# EAGLE design ESP-WROOM-32-Breakout (EAGLE 6.6.0)
REV: 1
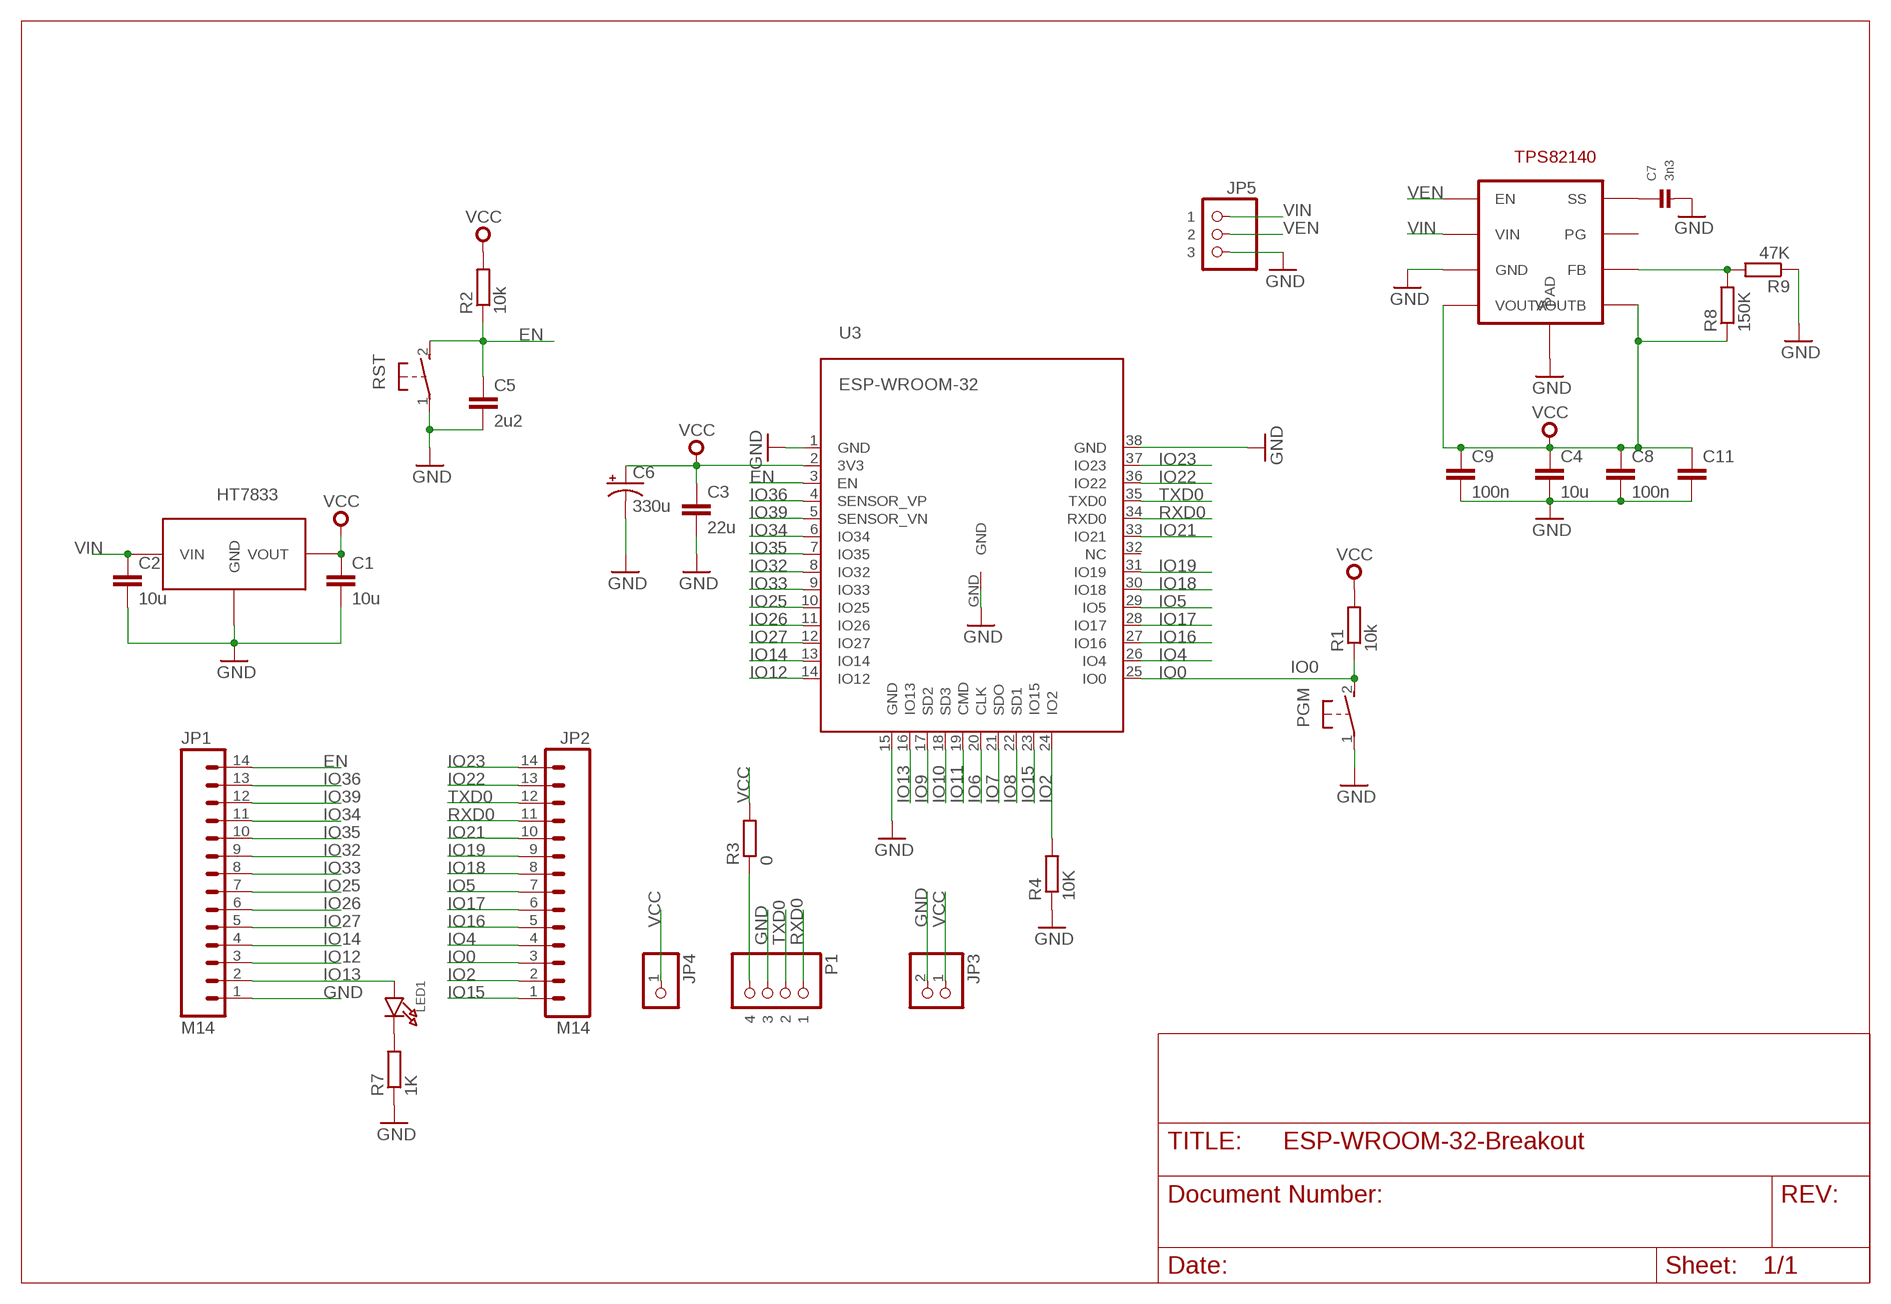
[diagram p0: schematic, sheet 1]

## Parts
C1  10u  C-EUC0603  [C0603]
C2  10u  C-EUC0603  [C0603]
C3  22u  CAP0805  [0805]
C4  10u  C-EUC0603  [C0603]
C5  2u2  C-EUC0603  [C0603]
C6  330u  CAP_POLSMD  [VISHAY_C]
C7  3n3  CAP_CERAMIC0603  [0603]
C8  100n  C-EUC0603  [C0603]
C9  100n  C-EUC0603  [C0603]
C11  CAPSMD  [GRM43D]
JP1  M14  [1X14]
JP2  M14  [1X14]
JP3  HEADER-1X2ROUND  [1X02_ROUND]
JP4  HEADER-1X1ROUND  [1X01_ROUND]
JP5  HEADER-1X3ROUND  [1X03_ROUND]
LED1  LED0603  [CHIPLED_0603]
P1  HEADER-1X4ROUND  [1X04_ROUND]
PGM  DTSM-3  [DTSM-3]
R1  10k  R-EU_R0603  [R0603]
R2  10k  R-EU_R0603  [R0603]
R3  0  R-EU_R0603  [R0603]
R4  10K  R-EU_R0603  [R0603]
R7  1K  R-EU_R0603  [R0603]
R8  150K  R-EU_R0603  [R0603]
R9  47K  R-EU_R0603  [R0603]
RST  DTSM-3  [DTSM-3]
U3  ESP-WROOM-32  [ESP-WROOM-32]
U$1  HT7833  HT7333  [SOT89]
U$2  TPS82140  [TPS82140]

## Nets
EN: C5.1 JP1.14 R2.1 RST.2 U3.3(EN)
GND [gnd]: C1.2 C2.2 C3.2 C4.2 C5.2 C6.- C7.2 C8.2 C9.2 C11.C JP1.1 JP3.2 JP5.3 P1.3 PGM.1 R4.1 R7.1 R9.1 RST.1 U3.1(GND) U3.15(GND) U3.38(GND) U3.GND U$1.GND U$2.P$3(GND) U$2.P$9(PAD)
IO0: JP2.3 PGM.2 R1.1 U3.25(IO0)
IO2: JP2.2 R4.2 U3.24(IO2)
IO4: JP2.4 U3.26(IO4)
IO5: JP2.7 U3.29(IO5)
IO6: U3.20(CLK)
IO7: U3.21(SDO)
IO8: U3.22(SD1)
IO9: U3.17(SD2)
IO10: U3.18(SD3)
IO11: U3.19(CMD)
IO12: JP1.3 U3.14(IO12)
IO13: JP1.2 LED1.A U3.16(IO13)
IO14: JP1.4 U3.13(IO14)
IO15: JP2.1 U3.23(IO15)
IO16: JP2.5 U3.27(IO16)
IO17: JP2.6 U3.28(IO17)
IO18: JP2.8 U3.30(IO18)
IO19: JP2.9 U3.31(IO19)
IO21: JP2.10 U3.33(IO21)
IO22: JP2.13 U3.36(IO22)
IO23: JP2.14 U3.37(IO23)
IO25: JP1.7 U3.10(IO25)
IO26: JP1.6 U3.11(IO26)
IO27: JP1.5 U3.12(IO27)
IO32: JP1.9 U3.8(IO32)
IO33: JP1.8 U3.9(IO33)
IO34: JP1.11 U3.6(IO34)
IO35: JP1.10 U3.7(IO35)
IO36: JP1.13 U3.4(SENSOR_VP)
IO39: JP1.12 U3.5(SENSOR_VN)
N$1: P1.4 R3.1
N$2: LED1.C R7.2
N$3: C7.1 U$2.P$8(SS)
N$4: R8.2 R9.2 U$2.P$6(FB)
RXD0: JP2.11 P1.1 U3.34(RXD0)
TXD0: JP2.12 P1.2 U3.35(TXD0)
VCC [vcc]: C1.1 C3.1 C4.1 C6.+ C8.1 C9.1 C11.A JP3.1 JP4.1 R1.2 R2.2 R3.2 R8.1 U3.2(3V3) U$1.VOUT U$2.P$4(VOUTA) U$2.P$5(VOUTB)
VEN: JP5.2 U$2.P$1(EN)
VIN: C2.1 JP5.1 U$1.VIN U$2.P$2(VIN)
Unconnected: U3.32(NC) U$2.P$7(PG)

## Library data of the parts
C1 C2 C4 C5 C8 C9 = rcl:C-EU: CAPACITOR, European symbol
C3 C11 = SparkFun-Passives:CAP: Capacitor Standard 0603 ceramic capacitor, and 0.1" leaded capacitor.
C6 = SparkFun-Passives:CAP_POL: Capacitor Polarized These are standard SMD and PTH capacitors. Normally 10uF, 47uF, and 100uF in electrolytic and tantalum varieties. Always verify the external diameter of the through hole cap, it varies with capacity, voltage, and manufacturer. The EIA devices should be standard.
C7 = hari:CAP_CERAMIC: Ceramic Capacitors 0402 - 0402 Surface Mount Capacitors 0.1uF 10V 10% [Digikey: 490-1318-2-ND] 0603 - 0603 Surface Mount Capacitors 16 pF 50V 5% [Digikey: 445-5051-2-ND] 22 pF 50V [Digikey: PCC220ACVTR-ND] 33 pF 50V 5% [Digikey: 490-1415-1-ND] 56pF 50V 5% [Digikey: 490-1421-1-ND] 220pF 50V 5% [Digikey: 445-1285-1-ND] 680 pF 50V 2200 pF 50V 5% C0G [Digikey: 445-1297-1-ND] 5600 pF 100V 5% X7R [Digikey: 478-3711-1-ND] 0.1 µF 25V 10% [Digikey: PCC2277TR-ND] 0.22 µF 16V 10% X7R [Digikey: 445-1318-1-ND] 1.0 µF 25V 10% [Digikey: 445-5146-2-ND] 0603 - RF Specific 3pF 250V +/-0.1pF RF [Digikey: 712-1347-1-ND] 18 pF 250V 5% [Digikey: 478-3505-1-ND or 712-1322-1-ND] 56 pF 250V 5% C0G RF [Digikey: 490-4867-1-ND] 68 pF 250V RF [Digikey: 490-4868-1-ND] 0805 - 0805 Surface Mount Capacitors 220 pF 250V 2% RF Ceramic Capacitor [Digikey: 712-1398-1-ND] 1000 pF 50V 2% NP0 Ceramic Capacitor [Digikey: 478-3760-1-ND] 0.1 µF 25V 10% Ceramic Capacitor [Digikey: PCC1828TR-ND] 1.0 µF 16V 10% Ceramic Capacitor[Digikey: 490-1691-2-ND] 10.0 µF 10V 10% Ceramic Capacitor[Digikey: 709-1228-1-ND] 1206 - 1206 Surface Mount Capacitors
JP1 JP2 = SparkFun-Connectors:M14: Header 14 Standard 14-pin 0.1" header. Use with straight break away headers (SKU : PRT-00116), right angle break away headers (PRT-00553), swiss pins (PRT-00743), machine pins (PRT-00117), and female headers (PRT-00115).
JP3 = hari:HEADER-1X2: PIN HEADER
JP4 = hari:HEADER-1X1: PIN HEADER
JP5 = hari:HEADER-1X3: PIN HEADER
LED1 = hari:LED: LED 0603 - 0603 Surface Mount Package Green LED - Low Power (3.9mcd, 2ma, 1.7Vf) Orange LED - Low Power (9.8mcd, 2ma, 1.8Vf) Red LED - Low Power (5mcd, 2ma, 1.8Vf) Yellow LED - Low Power (7mcd, 2ma, 1.8Vf) 0805 - 0805 Surface Mount Package 20mA: Red LED (104mcd, 20mA, Diffused) - LS R976 [Digikey: 475-1278-6-ND] Red LED (12mcd, 20mA, 2.0Vf, Clear) - APT2012EC [Digikey: 754-1128-1-ND] Green LED (15mcd, 20mA, 2.2Vf, Clear) - APT2012GC [Digikey: 754-1131-1-ND] Orange LED (160mcd, 20mA, 2.1Vf, Clear) - APT2012SECK [Digikey: 754-1130-1-ND] 2mA: Red LED (8.8mcd, 2mA, 1.8Vf, Clear) - Low Power [Digikey: 475-2510-1-ND] Green LED (5mcd, 2mA, 1.8Vf, Clear) - Low Power [Digikey: 475-2730-1-ND] Yellow LED (11.3mcd, 2mA, 1.8Vf, Clear) - Low Power [Digikey: 475-2555-1-ND] 1206 - 1206 Surface Mount Package Green LED (26mcd, 20mA, Diffused) - LG N971 [Digikey: 475-1407-6-ND] Red LED (15mcd, 20mA, Diffused) - LH N974 [Digikey: 475-1416-6-ND]
P1 = hari:HEADER-1X4: PIN HEADER
PGM RST = switch-tact:DTSM-3
R1-R4 R7-R9 = rcl:R-EU_: RESISTOR, European symbol
U3 = esp32:ESP-WROOM-32
U$1 = HT7333_SOT89:HT7333
U$2 = hari:TPS82140

## Net classes
0 default: width 0.254 mm, drill 0.305 mm, clearance 0.152 mm
1 gnd: width 0.635 mm, drill 0.635 mm, clearance 0.254 mm
2 vcc: width 0.406 mm, drill 0.406 mm, clearance 0.254 mm

## Board
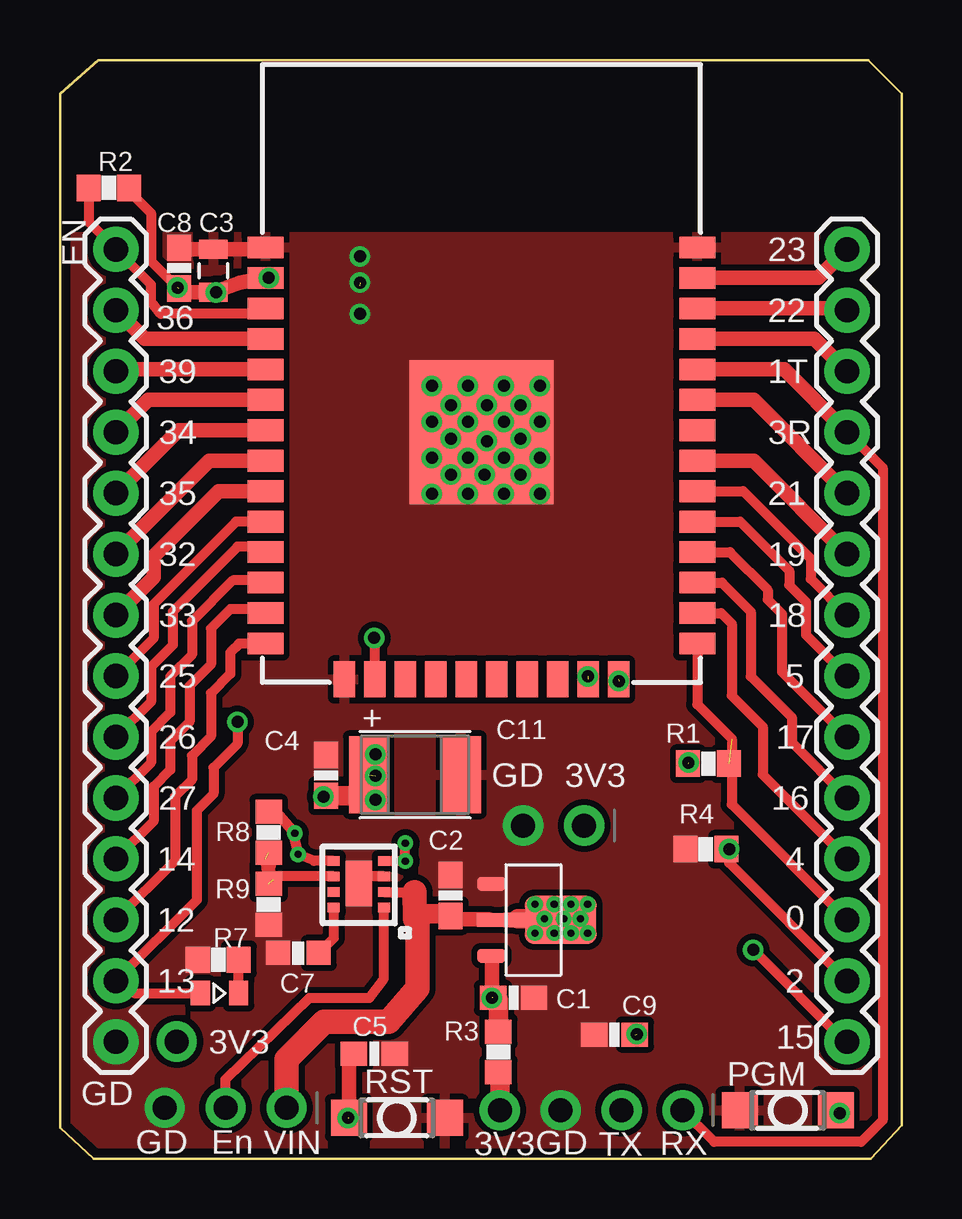
[diagram p1: board, top side]
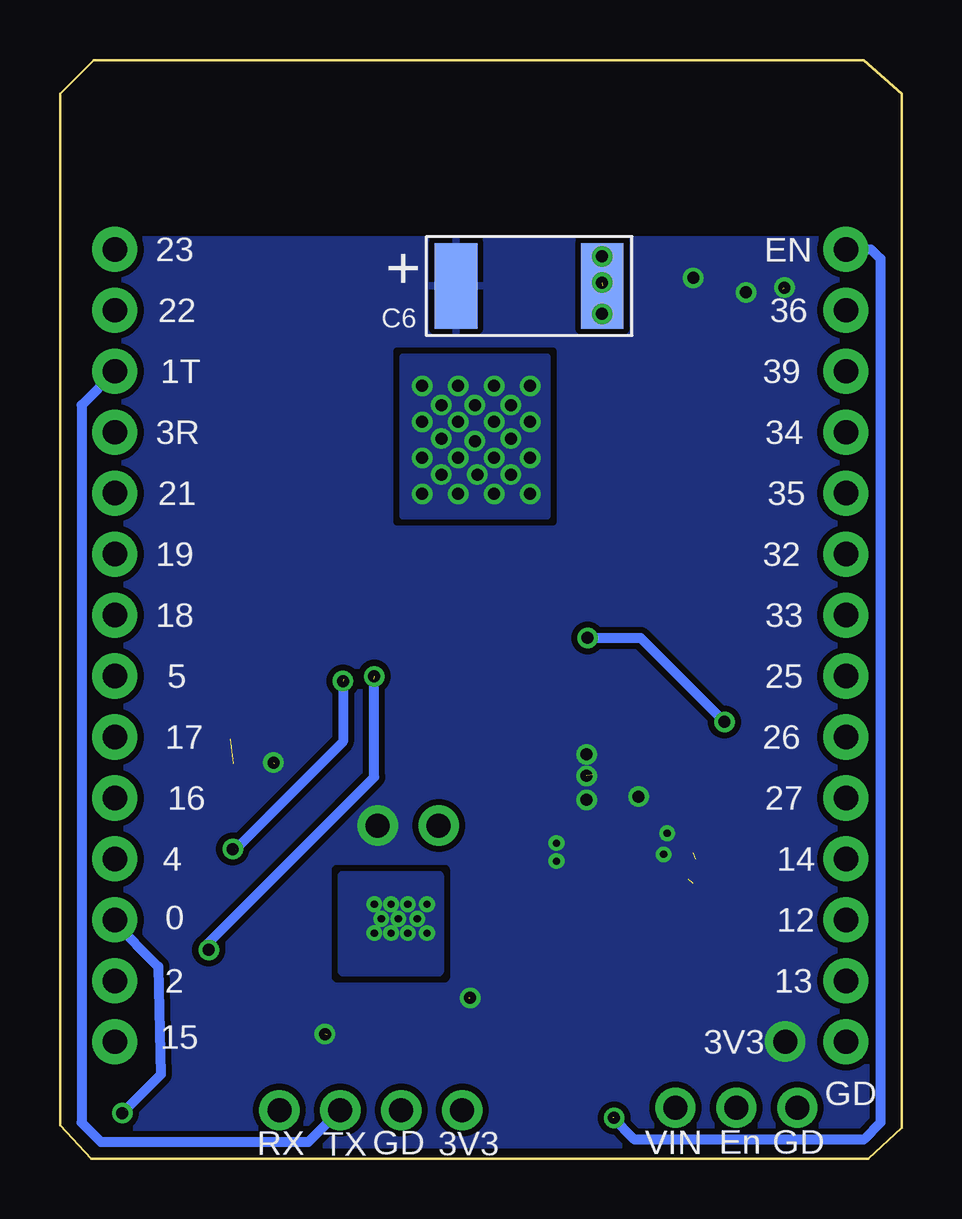
[diagram p2: board, bottom side, seen from below]

Size 35.1 x 45.78 mm. Coordinates in mm from the lower left corner, seen from the top.
Outline: 35.1,1.4 35.1,44.38 33.7,45.78 1.6,45.78 0,44.38 0,1.3 1.4,0 33.8,0 35.1,1.4
Copper layers (1*16): Top 0.0356mm / dielectric 1.5011mm / Bottom 0.0356mm
Design rules "oshpark-2layer": minimum track width 6mil, minimum drill 13mil, track to track 6mil, track to pad 6mil, pad to pad 6mil, via to via 6mil, smd to smd 6mil, copper to edge 15mil, drill to drill 6mil, minimum pad ring 7mil, minimum via ring 7mil, stop-mask expansion 4mil, vias tented up to drill 0mil, thermal gap 10mil

### Footprints (pad centres in the part's own frame; a part is rotated, then mirrored left to right if it is on the bottom)
C0603 = smd 1.1 x 1: 1 -0.85,0; 2 0.85,0
0805 = smd 0.8 x 1.2: 1 -0.9,0; 2 0.9,0
VISHAY_C = smd 3.556 x 1.778: + 0,3.048; - 0,-3.048
0603 = smd 1 x 1: 1 -0.85,0; 2 0.85,0
GRM43D = smd 1.65 x 3.2: A 1.927,0; C -1.927,0
1X14 = drill 1.016 pad 1.88: 1 0,0; 2 2.54,0; 3 5.08,0; 4 7.62,0; 5 10.16,0; 6 12.7,0; 7 15.24,0; 8 17.78,0; 9 20.32,0; 10 22.86,0; 11 25.4,0; 12 27.94,0; 13 30.48,0; 14 33.02,0
1X02_ROUND = drill 1 pad 1.676: 1 -1.27,0; 2 1.27,0
1X01_ROUND = drill 1 pad 1.676: 1 0,0
1X03_ROUND = drill 1 pad 1.676: 1 -2.54,0; 2 0,0; 3 2.54,0
CHIPLED_0603 = smd 1.016 x 0.8: A 0,-0.75; C 0,0.85
1X04_ROUND = drill 1 pad 1.676: 1 -3.81,0; 2 -1.27,0; 3 1.27,0; 4 3.81,0
DTSM-3 = smd 1.5 x 1.5: 1 -2,0; 2 2,0
R0603 = smd 1 x 1.1: 1 -0.85,0; 2 0.85,0
ESP-WROOM-32 = smd 0.9 x 1.5: 1 7.7,9; 2 6.43,9; 3 5.16,9; 4 3.89,9; 5 2.62,9; 6 1.35,9; 7 0.08,9; 8 -1.19,9; 9 -2.46,9; 10 -3.73,9; 11 -5,9; 12 -6.27,9; 13 -7.54,9; 14 -8.81,9; 25 -8.81,-9; 26 -7.54,-9; 27 -6.27,-9; 28 -5,-9; 29 -3.73,-9; 30 -2.46,-9; 31 -1.19,-9; 32 0.08,-9; 33 1.35,-9; 34 2.62,-9; 35 3.89,-9; 36 5.16,-9; 37 6.43,-9; 38 7.7,-9 | smd 1.5 x 0.9: 15 -10.3,5.715; 16 -10.3,4.445; 17 -10.3,3.175; 18 -10.3,1.905; 19 -10.3,0.635; 20 -10.3,-0.635; 21 -10.3,-1.905; 22 -10.3,-3.175; 23 -10.3,-4.445; 24 -10.3,-5.715 | smd 6 x 6: GND 0,0
SOT89 = smd 0.559 x 1.194: GND -1.499,-0.597; VIN 0,-0.597; VOUT 1.499,-0.597 | smd 0.6 x 2: P$1 0,0.9 | smd 2 x 3: P$4 0,2.286
TPS82140 = smd 0.5 x 0.4: P$1 0,0; P$2 0,-0.65; P$3 0,-1.3; P$4 0,-1.95; P$5 2.1,-1.95; P$6 2.1,-1.3; P$7 2.1,-0.65; P$8 2.1,0 | smd 1.1 x 1.9: P$9 1.05,-1

### Placement (x,y rotation side)
C1  18.91,6.7 0 top
C2  16.29,10.97 90 top
C3  6.4,37 90 top
C4  11.1,15.97 90 top
C5  13.11,4.37 0 top
C6  15.54,36.37 90 bottom
C7  9.94,8.57 180 top
C8  4.97,37.11 90 top
C9  23.12,5.17 180 top
C11  14.8,16 180 top
JP1  2.33,4.87 90 top
JP2  32.81,4.87 90 top
JP3  20.58,13.88 180 top
JP4  4.87,4.88 0 top
JP5  6.9,2.12 180 top
LED1  6.6,6.9 270 top
P1  22.14,2.02 180 top
PGM  30.34,2.01 0 top
R1  27.03,16.46 180 top
R2  2.04,40.45 0 top
R3  18.28,4.45 90 top
R4  26.92,12.9 0 top
R7  6.6,8.29 0 top
R8  8.7,13.6 270 top
R9  8.7,10.6 90 top
RST  14.05,1.7 180 top
U3  17.57,30.27 90 top
U$1  18.59,9.95 270 top
U$2  13.51,10.46 180 top

### Tracks (layer width: path | path; a pad name or v marks a point on that pad's centre or on a via)
EN  (via drill 0.5)  (2 unrouted)
  Top 0.305: 1.99,38.23 JP1.14 | U3.3 8.2,35.43 8,35.2
  Top 0.406: 12.05,4.36 C5.1 | R2.1 1.19,39.03 JP1.14 3.8,36.42 3.8,35.7 4.2,35.2 8,35.2
  Top 0.61: RST.2 12.05,4.36
  Bottom 0.406: JP1.14 1.29,37.89 0.9,37.5 0.9,1.5 1.6,0.8 11.14,0.8 RST.2
  other vias: 12,1.7
GND  (via drill 0.5)  (1 unrouted)
  Top 0.406: U$2.P$3 12.76,11.76 U$2.P$9
  Top 0.61: U3.1 8.73,37.87 8.4,37.9 C3.2 5.11,37.9 C8.2
  other vias: 12.5,35.2 12.5,37.6 12.5,36.5 15.5,32.2 17,32.2 18.5,32.2 15.5,30.7 17,30.7 18.5,30.7 15.5,29.2 17,29.2 18.5,29.2 15.5,27.7 17,27.7 18.5,27.7 20,32.2 20,30.7 20,29.2 20,27.7 17.8,31.4 19.2,31.4 16.3,31.4 16.3,30 17.8,29.9 19.2,30 16.3,28.5 17.7,28.5 19.2,28.5
  pour Top: 0.5,0.6 34.5,0.6 34.5,38.4 0.5,38.4
  pour Bottom (isolate 0.406): 14.8,26.8 20.8,26.8 20.8,32.8 14.8,32.8
  pour Bottom (isolate 0.406): 14.8,27.4 20.8,27.4 20.8,33.4 14.8,33.4
IO0  (via drill 0.5)  (2 unrouted)
  Top 0.406: U3.25 26.57,18.93 28,17.5 28,14.76 JP2.3
  Bottom 0.305: PGM.2 32.39,2.01 v32.5,1.9
  Bottom 0.406: JP2.3 32.91,9.91 31,8 30.9,3.5 v32.5,1.9
IO2  (via drill 0.5)  (2 unrouted)
  Top 0.406: v27.9,12.9 27.9,12.32 JP2.2
  Bottom 0.406: v23.3,19.9 23.3,17.37 R4.2 v27.9,12.9
IO4
  Top 0.406: U3.26 27.57,22.73 28,22.3 28,19.3 29.3,18 29.3,16 JP2.4
IO5
  Top 0.406: U3.29 28.36,26.54 30.4,24.5 30.4,23.9 31.1,23.2 31.1,21.82 JP2.7
IO12
  Top 0.406: U3.14 7.46,21.46 7.1,21.1 7.1,20.2 6.3,19.4 6.3,17.6 5.5,16.8 5.5,15.8 4.8,15.1 4.8,12.42 JP1.3
IO13  (via drill 0.5)
  Top 0.406: U3.16 13.13,21.67 v13.1,21.7 | v7.4,18.2 7.4,17.3 6.4,16.3 6.4,15.2 5.7,14.5 5.7,10.78 JP1.2 3.09,6.91 3.1,6.9 LED1.A
  Bottom 0.406: v13.1,21.7 10.9,21.7 v7.4,18.2
IO14
  Top 0.406: U3.13 8.27,22.73 8.1,22.9 7.1,22.9 6.3,22.1 6.3,20.6 5.4,19.7 5.4,18.2 4.6,17.4 4.6,16.2 3.9,15.5 3.9,14.06 JP1.4
IO15  (via drill 0.5)  (1 unrouted)
  Top 0.406: JP2.1 32.73,4.87 v28.9,8.7
  Bottom 0.406: v28.9,8.7 28.9,9 22,15.9 v22,20.1
IO16
  Top 0.406: U3.27 27.6,24 28.8,22.8 28.8,20.1 30.5,18.4 30.5,17.34 JP2.5
IO17
  Top 0.406: U3.28 27.93,25.27 29.5,23.7 29.5,23.3 30.1,22.7 30.1,20.28 JP2.6
IO18
  Top 0.406: U3.30 28.49,27.81 31.3,25 31.3,24.16 JP2.8
IO19
  Top 0.61: U3.31 28.92,29.08 JP2.9
IO21
  Top 0.61: U3.33 28.92,31.62 JP2.10
IO22
  Top 0.406: 32.73,35.43 JP2.13
  Top 0.61: U3.36 32.73,35.43
IO23
  Top 0.61: U3.37 31.62,36.7 JP2.14
IO25
  Top 0.406: U3.10 7.34,26.54 3.9,23.1 3.9,21.68 JP1.7
IO26
  Top 0.406: U3.11 8.33,25.27 8.1,25.5 7.4,25.5 4.7,22.8 4.7,21.4 3.8,20.5 3.8,19.04 JP1.6
IO27
  Top 0.406: U3.12 8.1,24 8,24.1 7.2,24.1 5.5,22.4 5.5,21 4.6,20.1 4.6,18.6 3.8,17.8 3.8,16.5 JP1.5
IO32
  Top 0.61: U3.8 6.22,29.08 JP1.9
IO33
  Top 0.61: U3.9 6.61,27.81 3.9,25.1 3.9,24.22 JP1.8
IO34
  Top 0.61: U3.6 3.68,31.62 JP1.11
IO35
  Top 0.61: U3.7 4.95,30.35 JP1.10
IO36
  Top 0.61: U3.4 3.52,34.16 JP1.13
IO39
  Top 0.406: 2.41,32.89 JP1.12
  Top 0.61: U3.5 2.41,32.89
N$1
  Top 0.406: R3.1 18.33,3.6
  Top 0.813: 18.33,3.6 P1.4
N$2
  Top 0.406: LED1.C R7.2
N$3
  Top 0.406: U$2.P$8 11.41,9.19 C7.1
N$4  (2 unrouted)
  Top 0.406: U$2.P$6 8.66,11.76 | 8.66,11.76 8.58,12.47 8.9,11.65 | 8.66,11.76 8.86,12.43
RXD0
  Top 0.305: JP2.11 32.83,30.27
  Top 0.406: 32.83,30.27 34.3,28.8 34.3,1.6 33.4,0.7 27.28,0.7 P1.1
  Top 0.61: U3.34 30.19,32.89 JP2.11
TXD0
  Top 0.406: 33.2,32.4 33.2,32.42 JP2.12
  Top 0.61: U3.35 31.44,34.16 33.2,32.4
  Bottom 0.305: JP2.12 32.81,32.79
  Bottom 0.406: 32.81,32.79 34.2,31.4 34.2,1.5 33.4,0.7 24.74,0.7 P1.2
VCC  (via drill 0.3, 0.5)  (5 unrouted)
  Top 0.305: R2.2 2.89,40.31
  Top 0.406: U$1.VOUT 18,8.35 | v18,6.7 18.28,6.6 | U$2.P$5 10.59,12.41 v9.93,12.68 9.71,13.55 | v14.39,12.41 14.39,13.08 14.43,13.12 | U$2.P$4 v14.39,12.41 | v14.39,12.41 v14.4,12.4 | R8.1 9,14.45 v9.79,13.56 | 2.89,40.31 3.8,39.4 3.8,37.4 v4.9,36.3 | 12.6,15.12 12.6,15.1 13.15,15.1 v13.15,14.95
  Top 0.61: 18,8.35 v18,6.7 | U3.2 7.49,36.5 C3.1 5.13,36.1 C8.1
  Top 0.813: 18.28,6.6 R3.2 | C4.1 12.6,15.12
  other vias: 8.7,36.7 24.05,5.19 10.98,15.09 26.2,16.5 14.4,13.15 13.15,16.85 6.5,36.1 13.15,15.95
  pour Bottom (isolate 0.254, rank 2): 0.3,0.3 34.8,0.3 34.8,38.3 0.3,38.3
VEN
  Top 0.406: JP5.2 6.9,3.3 10.4,6.7 12.9,6.7 13.5,7.5 U$2.P$1
VIN  (via drill 0.3)
  Top 0.406: 16.29,9.95 C2.1 16.21,10.2 | U$2.P$2 14.79,11.11 | 14.8,10 15.2,10.2 14.9,9.9
  Top 0.5: 19.05,9.95 U$1.VIN 17.89,9.97 | C2.1 16.48,10.12 16.55,9.97
  Top 0.61: 19.05,9.95 19.1,10 | 16.55,9.97 17.89,9.97
  Top 0.813: 15.2,10.2 16.21,10.2 | 19.1,10 v21,10
  Top 1.016: 14.79,11.11 14.8,10 | JP5.1 9.44,4.14 11,5.7 13.7,5.7 14.9,7.1 14.9,9.9
  other vias: 19.8,10.6 21.3,10.6 21.3,9.4 19.8,9.4 20.6,9.4 22,10.6 22,9.4 20.6,10.6 20.2,10 21.7,10
  pour Bottom: 19.3,11.3 19.3,7.8 23.3,7.8 23.3,11.8 19.3,11.8

### Text on the board
tNames: 23 | EN | 36 | 22 | 39 | 1T | 34 | 3R | 35 | 21 | 32 | 19 | 33 | 18 | 25 | 5 | 26 | + | 17 | 27 | GD | 3V3 | 16 | 14 | 4 | 12 | 0 | 13 | 2 | 3V3 | 15 | GD | GD | En | VIN | 3V3 | GD | TX | RX
bNames: 23 | EN | 36 | 22 | 39 | 1T | 34 | 3R | 35 | 21 | 32 | 19 | 33 | 18 | 25 | 5 | 26 | 17 | 27 | 16 | 14 | 4 | 12 | 0 | 13 | 2 | 3V3 | 15 | GD | GD | En | VIN | 3V3 | GD | TX | RX